# EAGLE schematic mini_mouse (EAGLE 9.2.0)
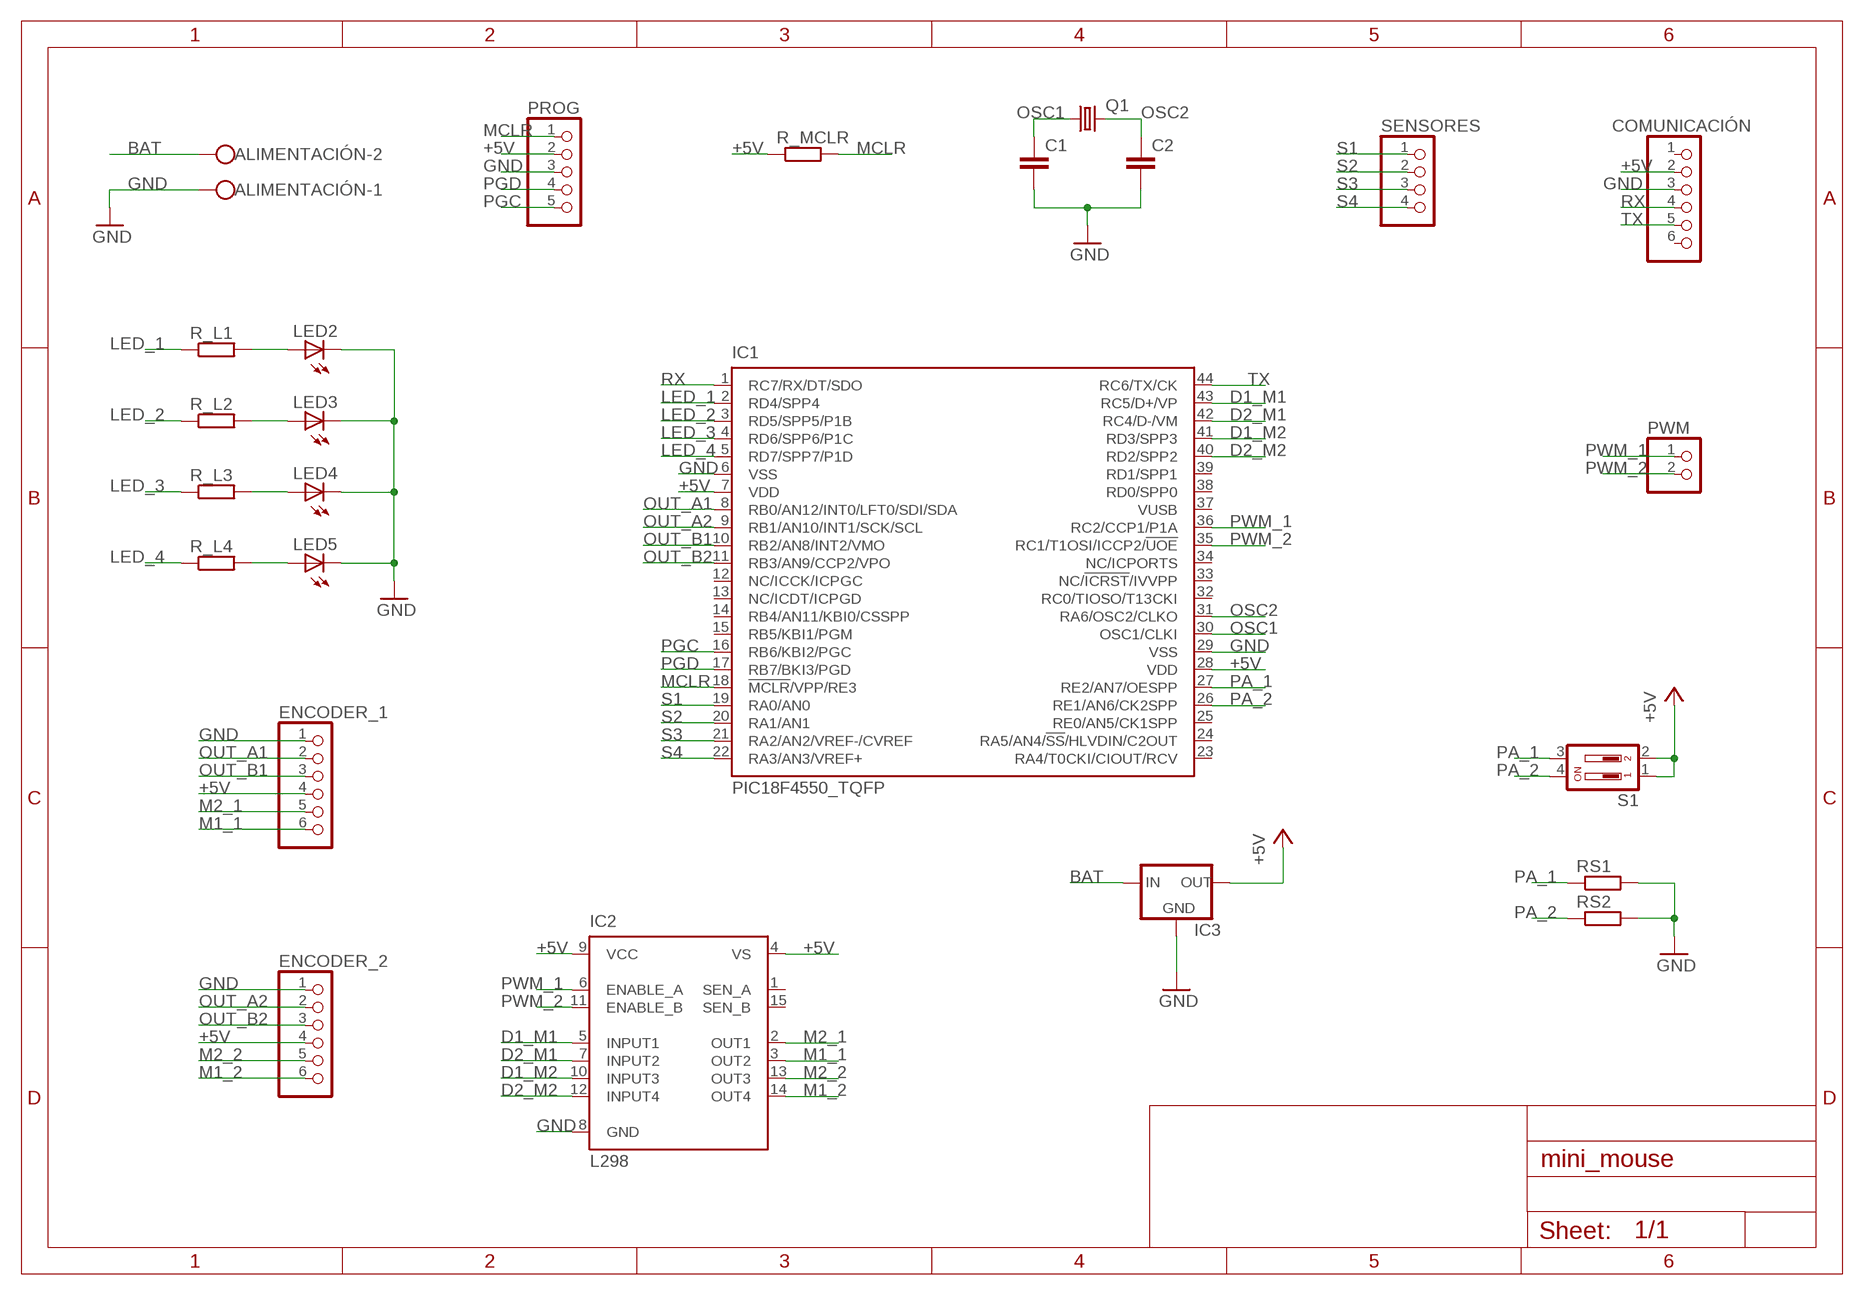
[diagram p0: schematic, sheet 1]

## Parts
ALIMENTACIÓN  W237-102  [W237-102]
C1  C-EUC0603  [C0603]
C2  C-EUC0603  [C0603]
COMUNICACIÓN  PINHD-1X6  [1X06]
ENCODER_1  PINHD-1X6  [1X06]
ENCODER_2  PINHD-1X6  [1X06]
IC1  PIC18F4550_TQFP  [TQFP44]
IC2  L298  [MULTIWATT-15]
IC3  78XXL  [78XXL]
LED2  LED3MM  [LED3MM]
LED3  LED3MM  [LED3MM]
LED4  LED3MM  [LED3MM]
LED5  LED3MM  [LED3MM]
PROG  PINHD-1X5  [1X05]
PWM  PINHD-1X2  [1X02]
Q1  CRYSTALHC49U-V  [HC49U-V]
R_L1  R-EU_R0603  [R0603]
R_L2  R-EU_R0603  [R0603]
R_L3  R-EU_R0603  [R0603]
R_L4  R-EU_R0603  [R0603]
R_MCLR  R-EU_R0603  [R0603]
RS1  R-EU_R0603  [R0603]
RS2  R-EU_R0603  [R0603]
S1  DIP02YL  [DIP02YL]
SENSORES  PINHD-1X4  [1X04]

## Nets
+5V: COMUNICACIÓN.2 ENCODER_1.4 ENCODER_2.4 IC1.7(VDD) IC1.28(VDD) IC2.4(VS) IC2.9(VCC) IC3.OUT PROG.2 R_MCLR.1 S1.1 S1.2
BAT: ALIMENTACIÓN.2 IC3.IN
D1_M1: IC1.43(RC5/D+/VP) IC2.5(INPUT1)
D1_M2: IC1.41(RD3/SPP3) IC2.10(INPUT3)
D2_M1: IC1.42(RC4/D-/VM) IC2.7(INPUT2)
D2_M2: IC1.40(RD2/SPP2) IC2.12(INPUT4)
GND: ALIMENTACIÓN.1 C1.2 C2.2 COMUNICACIÓN.3 ENCODER_1.1 ENCODER_2.1 IC1.6(VSS) IC1.29(VSS) IC2.8(GND) IC3.GND LED2.K(C) LED3.K(C) LED4.K(C) LED5.K(C) PROG.3 RS1.2 RS2.2
LED_1: IC1.2(RD4/SPP4) R_L1.1
LED_2: IC1.3(RD5/SPP5/P1B) R_L2.1
LED_3: IC1.4(RD6/SPP6/P1C) R_L3.1
LED_4: IC1.5(RD7/SPP7/P1D) R_L4.1
M1_1: ENCODER_1.6 IC2.3(OUT2)
M1_2: ENCODER_2.6 IC2.14(OUT4)
M2_1: ENCODER_1.5 IC2.2(OUT1)
M2_2: ENCODER_2.5 IC2.13(OUT3)
MCLR: IC1.18(!MCLR!/VPP/RE3) PROG.1 R_MCLR.2
N$1: LED2.A R_L1.2
N$2: LED3.A R_L2.2
N$3: LED4.A R_L3.2
N$4: LED5.A R_L4.2
OSC1: C1.1 IC1.30(OSC1/CLKI) Q1.1
OSC2: C2.1 IC1.31(RA6/OSC2/CLKO) Q1.2
OUT_A1: ENCODER_1.2 IC1.8(RB0/AN12/INT0/LFT0/SDI/SDA)
OUT_A2: ENCODER_2.2 IC1.9(RB1/AN10/INT1/SCK/SCL)
OUT_B1: ENCODER_1.3 IC1.10(RB2/AN8/INT2/VMO)
OUT_B2: ENCODER_2.3 IC1.11(RB3/AN9/CCP2/VPO)
PA_1: IC1.27(RE2/AN7/OESPP) RS1.1 S1.3
PA_2: IC1.26(RE1/AN6/CK2SPP) RS2.1 S1.4
PGC: IC1.16(RB6/KBI2/PGC) PROG.5
PGD: IC1.17(RB7/BKI3/PGD) PROG.4
PWM_1: IC1.36(RC2/CCP1/P1A) IC2.6(ENABLE_A) PWM.1
PWM_2: IC1.35(RC1/T1OSI/ICCP2/!UOE) IC2.11(ENABLE_B) PWM.2
RX: COMUNICACIÓN.4 IC1.1(RC7/RX/DT/SDO)
S1: IC1.19(RA0/AN0) SENSORES.1
S2: IC1.20(RA1/AN1) SENSORES.2
S3: IC1.21(RA2/AN2/VREF-/CVREF) SENSORES.3
S4: IC1.22(RA3/AN3/VREF+) SENSORES.4
TX: COMUNICACIÓN.5 IC1.44(RC6/TX/CK)
Unconnected: COMUNICACIÓN.1 COMUNICACIÓN.6 IC1.12(NC/ICCK/ICPGC) IC1.13(NC/ICDT/ICPGD) IC1.14(RB4/AN11/KBI0/CSSPP) IC1.15(RB5/KBI1/PGM) IC1.23(RA4/T0CKI/CIOUT/RCV) IC1.24(RA5/AN4/!SS!/HLVDIN/C2OUT) IC1.25(RE0/AN5/CK1SPP) IC1.32(RC0/TIOSO/T13CKI) IC1.33(NC/!ICRST!/IVVPP) IC1.34(NC/ICPORTS) IC1.37(VUSB) IC1.38(RD0/SPP0) IC1.39(RD1/SPP1) IC2.1(SEN_A) IC2.15(SEN_B)

## Library data of the parts
ALIMENTACIÓN = con-wago-500:W237-102: WAGO SCREW CLAMP; MPN: 237-102; OC_FARNELL: unknown; OC_NEWARK: 70K9898
C1 C2 = rcl:C-EU: CAPACITOR, European symbol; SPICEPREFIX: C
COMUNICACIÓN ENCODER_1 ENCODER_2 = pinhead:PINHD-1X6: PIN HEADER
IC1 = microchip:PIC18F4*_TQFP: USB Microcontrollers with nanoWatt Technology High-Performance, Enhanced Flash, 28/40/44-Pin, Source: http://ww1.microchip.com/downloads/en/devicedoc/39632c.pdf; MF: MICROCHIP; MPN: PIC18F4550-I/PT; OC_FARNELL: 9321365; OC_NEWARK: 08J9633
IC2 = st-microelectronics:L298: DUAL FULL-BRIDGE DRIVER; MPN: L298N; OC_FARNELL: 1589425; OC_NEWARK: 32M1527
IC3 = v-reg:78XXL: VOLTAGE REGULATOR
LED2-LED5 = led:LED: LED OSRAM: - CHIPLED LG R971, LG N971, LY N971, LG Q971, LY Q971, LO R971, LY R971 LH N974, LH R974 LS Q976, LO Q976, LY Q976 LO Q996 - Hyper CHIPLED LW Q18S LB Q993, LB Q99A, LB R99A - SideLED LS A670, LO A670, LY A670, LG A670, LP A670 LB A673, LV A673, LT A673, LW A673 LH A674 LY A675 LS A676, LA A676, LO A676, LY A676, LW A676 LS A679, LY A679, LG A679 - Hyper Micro SIDELED® LS Y876, LA Y876, LO Y876, LY Y876 LT Y87S - SmartLED LW L88C, LW L88S LB L89C, LB L89S, LG L890 LS L89K, LO L89K, LY L89K LS L896, LA L896, LO L896, LY L896 - TOPLED LS T670, LO T670, LY T670, LG T670, LP T670 LSG T670, LSP T670, LSY T670, LOP T670, LYG T670 LG T671, LOG T671, LSG T671 LB T673, LV T673, LT T673, LW T673 LH T674 LS T676, LA T676, LO T676, LY T676, LB T676, LH T676, LSB T676, LW T676 LB T67C, LV T67C, LT T67C, LS T67K, LO T67K, LY T67K, LW E67C LS E67B, LA E67B, LO E67B, LY E67B, LB E67C, LV E67C, LT E67C LW T67C LS T679, LY T679, LG T679 LS T770, LO T770, LY T770, LG T770, LP T770 LB T773, LV T773, LT T773, LW T773 LH T774 LS E675, LA E675, LY E675, LS T675 LS T776, LA T776, LO T776, LY T776, LB T776 LHGB T686 LT T68C, LB T68C - Hyper Mini TOPLED® LB M676 - Mini TOPLED Santana® LG M470 LS M47K, LO M47K, LY M47K Source: http://www.osram.convergy.de LUXEON: - LUMILED® LXK2-PW12-R00, LXK2-PW12-S00, LXK2-PW14-U00, LXK2-PW14-V00 LXK2-PM12-R00, LXK2-PM12-S00, LXK2-PM14-U00 LXK2-PE12-Q00, LXK2-PE12-R00, LXK2-PE12-S00, LXK2-PE14-T00, LXK2-PE14-U00 LXK2-PB12-K00, LXK2-PB12-L00, LXK2-PB12-M00, LXK2-PB14-N00, LXK2-PB14-P00, LXK2-PB14-Q00 LXK2-PR12-L00, LXK2-PR12-M00, LXK2-PR14-Q00, LXK2-PR14-R00 LXK2-PD12-Q00, LXK2-PD12-R00, LXK2-PD12-S00 LXK2-PH12-R00, LXK2-PH12-S00 LXK2-PL12-P00, LXK2-PL12-Q00, LXK2-PL12-R00 Source: www.luxeon.com KINGBRIGHT: KA-3528ASYC Source: www.kingbright.com
PROG = pinhead:PINHD-1X5: PIN HEADER
PWM = pinhead:PINHD-1X2: PIN HEADER
Q1 = crystal:CRYSTAL: CRYSTAL; OC_FARNELL: 1666969; OC_NEWARK: unknown
R_L1-R_L4 R_MCLR RS1 RS2 = rcl:R-EU_: RESISTOR, European symbol; SPICEPREFIX: R
S1 = switch-dil:DIP02YL: DIL/CODE SWITCH; OC_FARNELL: unknown; OC_NEWARK: unknown
SENSORES = pinhead:PINHD-1X4: PIN HEADER